# Altium schematic sheet MB785.SchDoc
size A4; Revision: A.1(PCB.SCH)
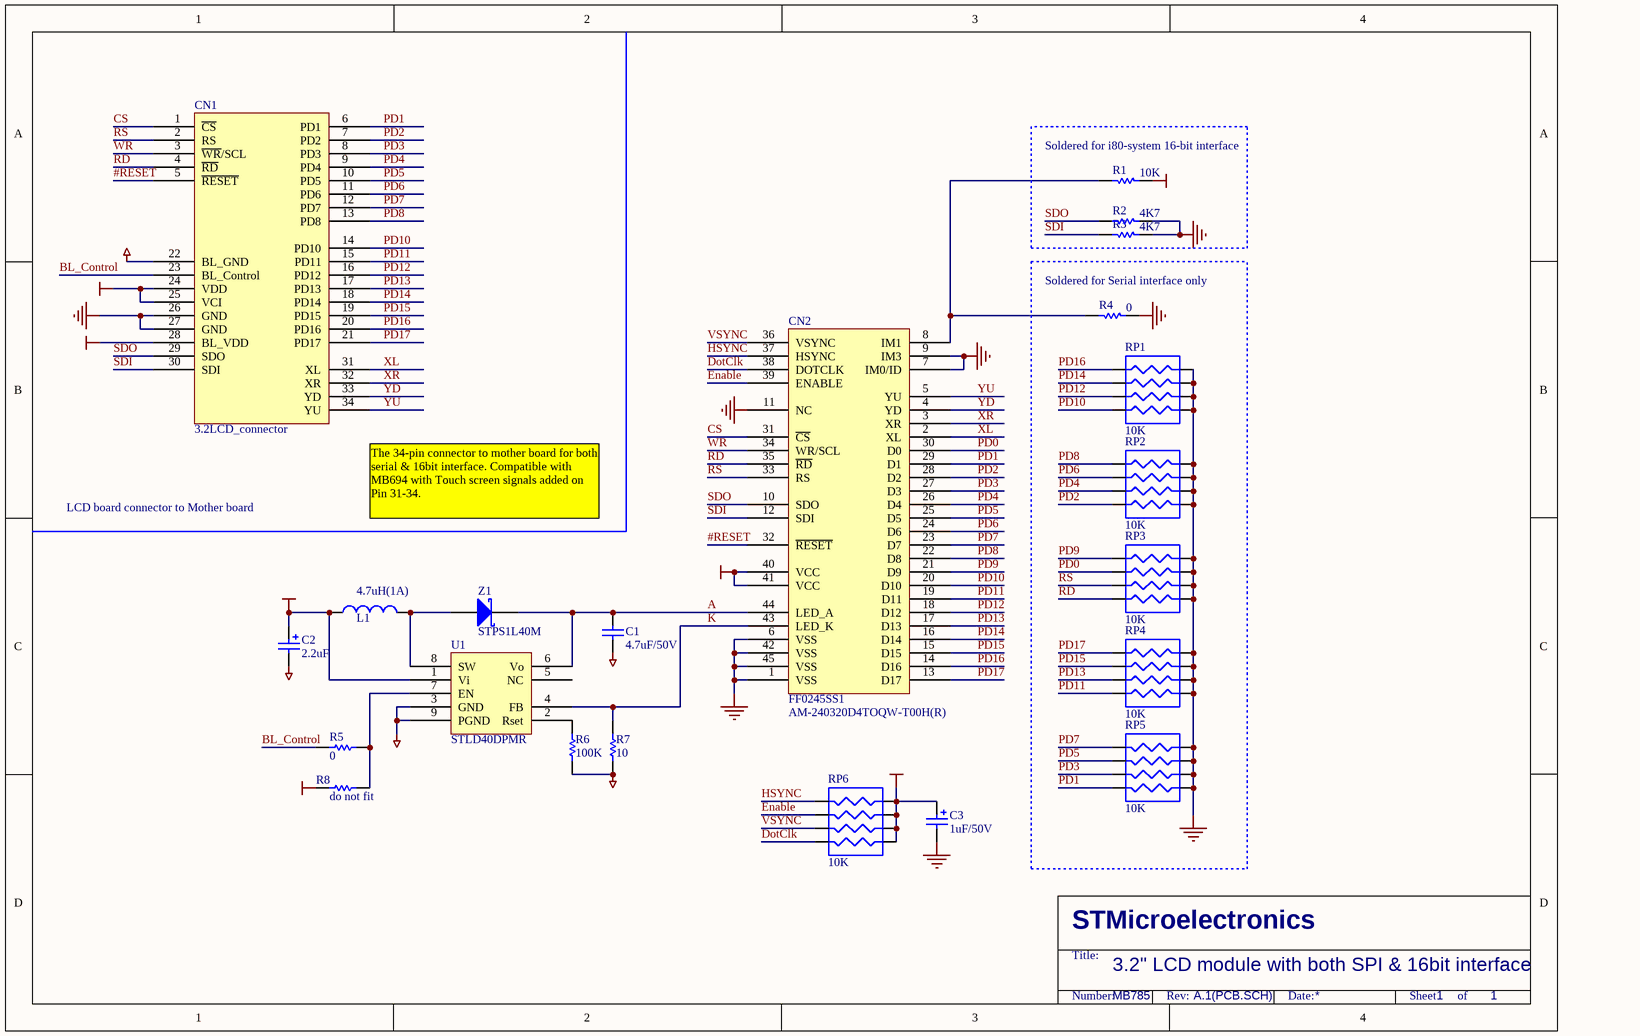
[diagram p0: MB785.SchDoc]

## Parts
C1  4.7uF/50V  [TAN-B]
C2  2.2uF  [TAN-A]
C3  1uF/50V  [TAN-B]
CN1  3.2LCD_connector  [2*17P]
CN2  FF0245SS1  [FF0245SS1]
L1  4.7uH(1A)  [3225]
R1  10K  [0603R]
R2  4K7  [0603R]
R3  4K7  [0603R]
R4  0  [0603R]
R5  0  [0603R]
R6  100K  [0603R]
R7  10  [0603R]
R8  do not fit  [0603R]
RP1  10K  [RES4B]
RP2  10K  [RES4B]
RP3  10K  [RES4B]
RP4  10K  [RES4B]
RP5  10K  [RES4B]
RP6  10K  [RES4B]
U1  STLD40DPMR  [QFNT8]
Z1  STPS1L40M  [DO216AA]

## Blocks framed on the sheet
Soldered for i80-system 16-bit interface: R1-R3

## Nets
BLGND: C1.1 C2.2 CN1.22(BL_GND) R6.2 R7.1 U1.3(GND) U1.9(PGND)
BLVDD: C2.1 CN1.28(BL_VDD) L1.1 R8.2 U1.1(Vi)
GND: C3.2 CN1.26(GND) CN1.27(GND) CN2.1(VSS) CN2.6(VSS) CN2.7(IM0/ID) CN2.9(IM3) CN2.11(NC) CN2.42(VSS) CN2.45(VSS) R2.1 R3.1 R4.2 RP1.2(R1) RP1.4(R3) RP1.6(R2) RP1.8(R0) RP2.2(R1) RP2.4(R3) RP2.6(R2) RP2.8(R0) RP3.2(R1) RP3.4(R3) RP3.6(R2) RP3.8(R0) RP4.2(R1) RP4.4(R3) RP4.6(R2) RP4.8(R0) RP5.2(R1) RP5.4(R3) RP5.6(R2) RP5.8(R0)
VDD: C3.1 CN1.24(VDD) CN1.25(VCI) CN2.40(VCC) CN2.41(VCC) R1.2 RP6.2(R1) RP6.4(R3) RP6.6(R2) RP6.8(R0)
#RESET: CN1.5(~{RESET}) CN2.32(~{RESET})
A: C1.2 CN2.44(LED_A) U1.6(Vo) Z1.2(K)
BL_Control: CN1.23(BL_Control) R5.2
CS: CN1.1(~{CS}) CN2.31(~{CS})
DotClk: CN2.38(DOTCLK) RP6.1(R0)
Enable: CN2.39(ENABLE) RP6.5(R3)
HSYNC: CN2.37(HSYNC) RP6.7(R1)
K: CN2.43(LED_K) R7.2 U1.4(FB)
PD0: CN2.30(D0) RP3.3(R2)
PD1: CN1.6(PD1) CN2.29(D1) RP5.1(R0)
PD2: CN1.7(PD2) CN2.28(D2) RP2.7(R1)
PD3: CN1.8(PD3) CN2.27(D3) RP5.3(R2)
PD4: CN1.9(PD4) CN2.26(D4) RP2.5(R3)
PD5: CN1.10(PD5) CN2.25(D5) RP5.5(R3)
PD6: CN1.11(PD6) CN2.24(D6) RP2.3(R2)
PD7: CN1.12(PD7) CN2.23(D7) RP5.7(R1)
PD8: CN1.13(PD8) CN2.22(D8) RP2.1(R0)
PD9: CN2.21(D9) RP3.1(R0)
PD10: CN1.14(PD10) CN2.20(D10) RP1.7(R1)
PD11: CN1.15(PD11) CN2.19(D11) RP4.7(R1)
PD12: CN1.16(PD12) CN2.18(D12) RP1.5(R3)
PD13: CN1.17(PD13) CN2.17(D13) RP4.5(R3)
PD14: CN1.18(PD14) CN2.16(D14) RP1.3(R2)
PD15: CN1.19(PD15) CN2.15(D15) RP4.3(R2)
PD16: CN1.20(PD16) CN2.14(D16) RP1.1(R0)
PD17: CN1.21(PD17) CN2.13(D17) RP4.1(R0)
RD: CN1.4(~{RD}) CN2.35(~{RD}) RP3.7(R1)
RS: CN1.2(RS) CN2.33(RS) RP3.5(R3)
SDI: CN1.30(SDI) CN2.12(SDI) R3.2
SDO: CN1.29(SDO) CN2.10(SDO) R2.2
VSYNC: CN2.36(VSYNC) RP6.3(R2)
WR: CN1.3(~{WR}/SCL) CN2.34(WR/SCL)
XL: CN1.31(XL) CN2.2(XL)
XR: CN1.32(XR) CN2.3(XR)
YD: CN1.33(YD) CN2.4(YD)
YU: CN1.34(YU) CN2.5(YU)
NetCN2_8: CN2.8(IM1) R1.1 R4.1
NetL1_2: L1.2 U1.8(SW) Z1.1(A)
NetR5_1: R5.1 R8.1 U1.7(EN)
NetR6_1: R6.1 U1.2(Rset)

Not connected (* = marked no-connect by the designer): U1 5(NC)

## Notes on the sheet
- Soldered for Serial interface only
- LCD board connector to Mother board
- (near CN1) The 34-pin connector to mother board for both serial & 16bit interface. Compatible with MB694 with Touch screen signals added on Pin 31-34.
- (near CN2) AM-240320D4TOQW-T00H(R)
- 3.2" LCD module with both SPI & 16bit interface
- MB785
- 1
- STMicroelectronics
- Title:
- Number:
- Rev:
- Date:
- Sheet       of

## Library data of the parts
C1 = CAP: Capacitor; Value: 100pF; Published: 8-Jun-2000; Revision: July-2002: Re-released for DXP Platform.; Publisher: Altium Limited
C2 C3 = Cap Pol1: Polarized Capacitor (Radial); Value: 100pF; Published: 8-Jun-2000; Revision: July-2002: Re-released for DXP Platform.; Publisher: Altium Limited
L1 = Inductor: Value: 100uH; Published: 8-Jun-2000; Revision: July-2002: Re-released for DXP Platform.; Publisher: Altium Limited
R1-R8 = Res1: Resistor; Value: 1K; Published: 8-Jun-2000; Revision: July-2002: Re-released for DXP Platform.; Publisher: Altium Limited
RP1-RP6 = RES4B
Z1 = D Schottky: Schottky Diode; Code - JEDEC: DO-214-AA; Published: 8-Jun-2000; Revision: July-2002: Re-released for DXP Platform.; Publisher: Altium Limited